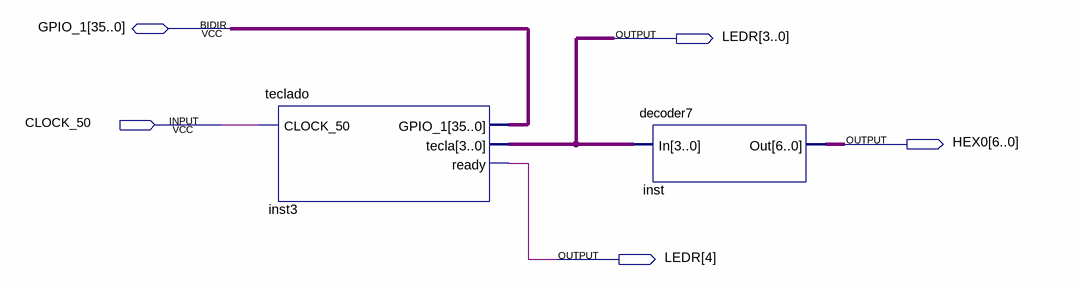
[diagram p0: schematic sheet]
// Quartus schematic top.bdf as structural Verilog: 2 symbols, 5 pins
module top (
  input  CLOCK_50,
  inout  [35:0] GPIO_1,
  output [4:0] LEDR,
  output [6:0] HEX0
);

  teclado inst3 (.CLOCK_50(CLOCK_50), .tecla(LEDR[3:0]), .ready(LEDR[4]), .GPIO_1(GPIO_1));
  decoder7 inst (.In(LEDR[3:0]), .Out(HEX0));
endmodule
